# EAGLE design PPM2DSM (EAGLE 6.6.0)
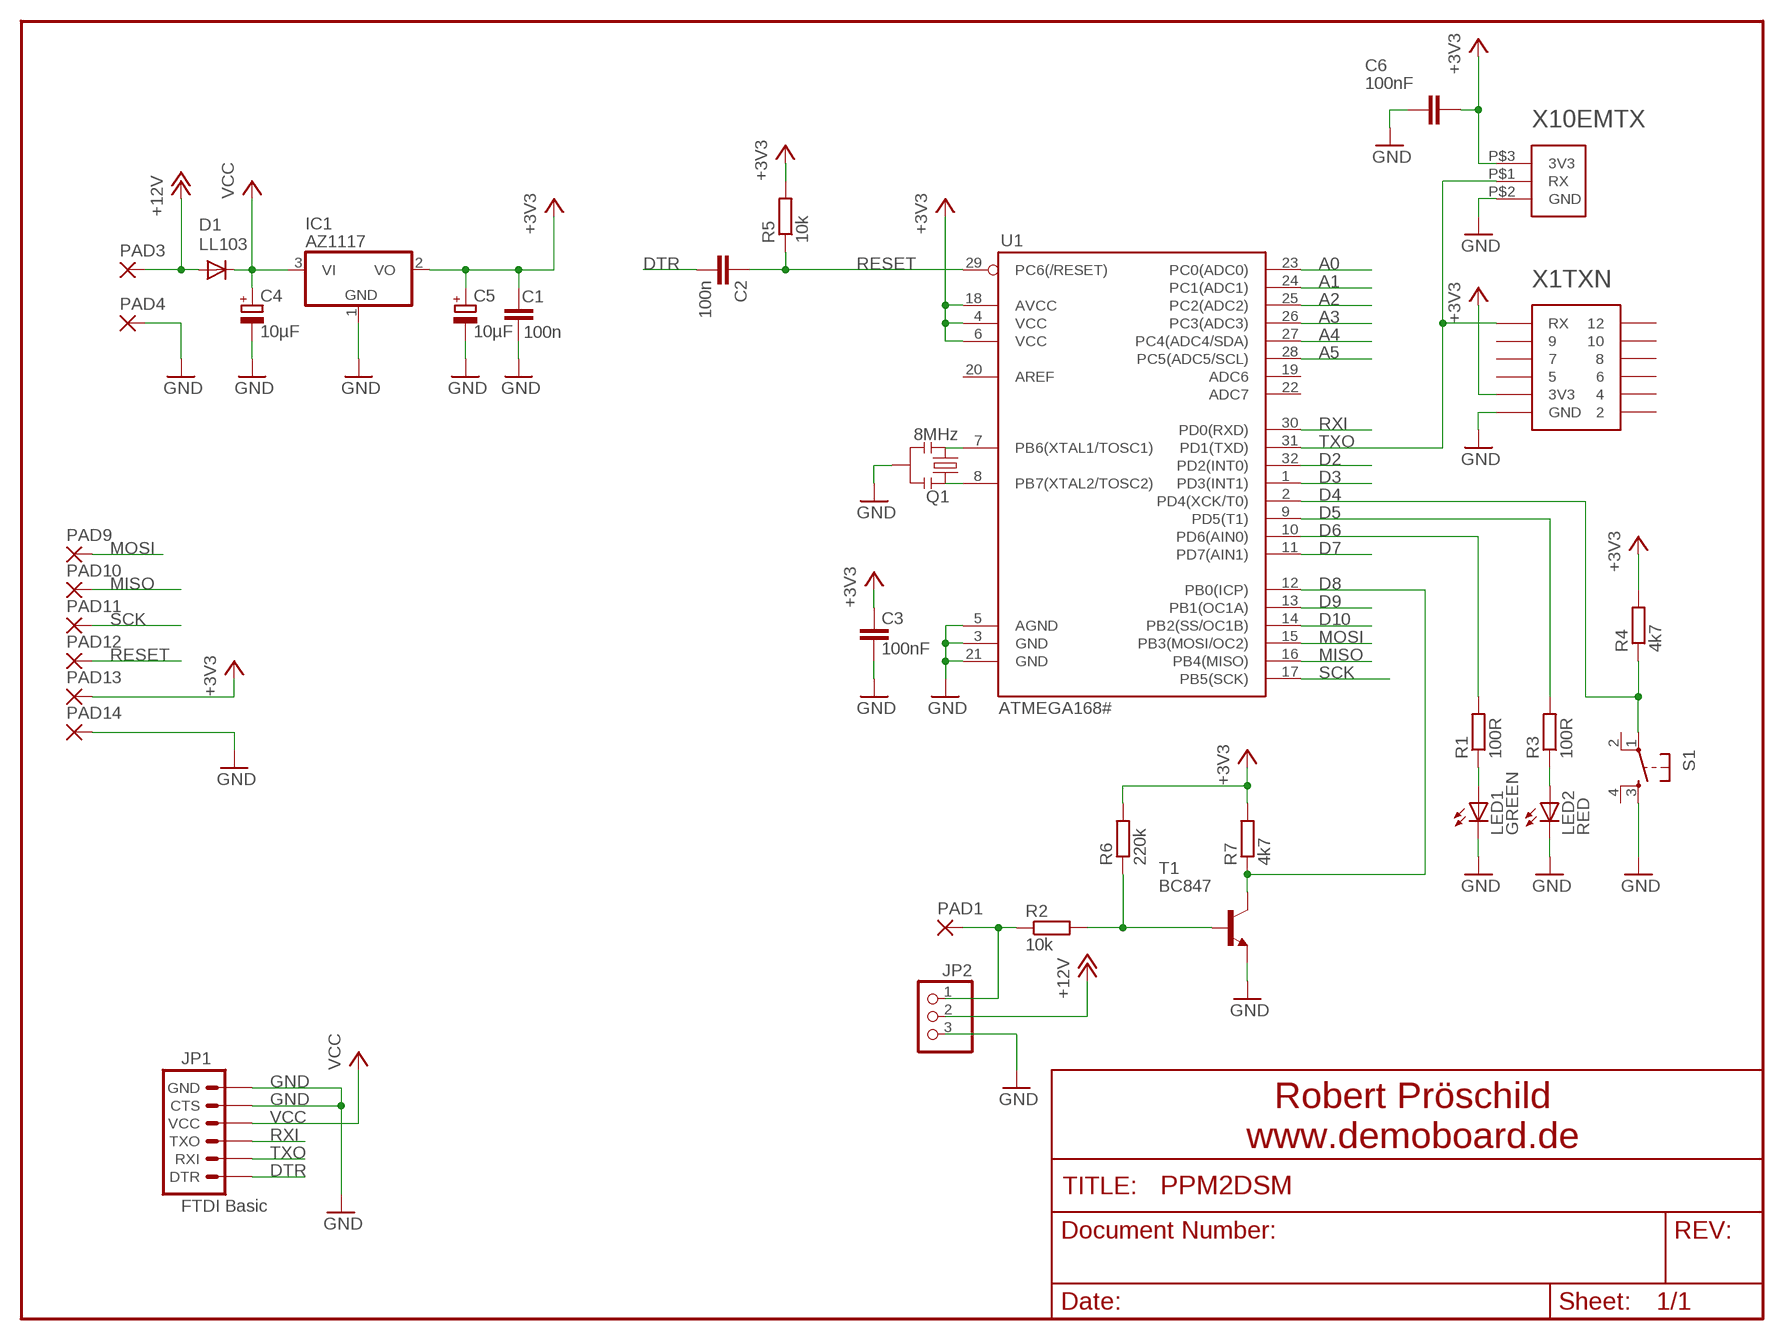
[diagram p0: schematic, sheet 1]

## Parts
C1  100n  C-EUC0805  [C0805]
C2  100n  C-EUC0805  [C0805]
C3  100nF  C-EUC0805  [C0805]
C4  10µF  CPOL-EUCT6032  [CT6032]
C5  10µF  CPOL-EUCT6032  [CT6032]
C6  100nF  C-EUC0805  [C0805]
D1  LL103  DIODE-MINIMELF  [MINIMELF]
IC1  AZ1117  [SOT223]
IC2  X10EMTX  [X10EMTX]
IC3  X1TX0  [X1TX0]
JP1  FTDI Basic  ARDUINO_SERIAL_PROGRAMPTH  [1X06]
JP2  PINHD-1X3/90  [1X03/90]
LED1  GREEN  LEDCHIPLED_1206  [CHIPLED_1206]
LED2  RED  LEDCHIPLED_1206  [CHIPLED_1206]
PAD1  SMD5  [SMD2,54-5,08]
PAD3  SMD5  [SMD2,54-5,08]
PAD4  SMD5  [SMD2,54-5,08]
PAD9  1,6/0,9  [1,6/0,9]
PAD10  1,6/0,9  [1,6/0,9]
PAD11  1,6/0,9  [1,6/0,9]
PAD12  1,6/0,9  [1,6/0,9]
PAD13  1,6/0,9  [1,6/0,9]
PAD14  1,6/0,9  [1,6/0,9]
Q1  8MHz  RESONATORSMD  [RESONATOR-SMD]
R1  100R  R-EU_R0805  [R0805]
R2  10k  R-EU_R0805  [R0805]
R3  100R  R-EU_R0805  [R0805]
R4  4k7  R-EU_R0805  [R0805]
R5  10k  R-EU_R0805  [R0805]
R6  220k  R-EU_R0805  [R0805]
R7  4k7  R-EU_R0805  [R0805]
S1  LSG  [SCHURTER_LSG]
T1  BC847  [SOT23]
U1  ATMEGA168#  ATMEGA168  [TQFP32-08]

## Nets
+3V3: C1.2 C3.2 C5.+ C6.2 IC1.2(VO) IC2.P$3(3V3) IC3.3(3V3) PAD13.1(P) R4.2 R5.2 R6.2 R7.2 U1.4(VCC) U1.6(VCC) U1.18(AVCC)
+12V: D1.A JP2.2 PAD3.1(P)
A0: U1.23(PC0(ADC0))
A1: U1.24(PC1(ADC1))
A2: U1.25(PC2(ADC2))
A3: U1.26(PC3(ADC3))
A4: U1.27(PC4(ADC4/SDA))
A5: U1.28(PC5(ADC5/SCL))
D2: U1.32(PD2(INT0))
D3: U1.1(PD3(INT1))
D4: R4.1 S1.1(P) U1.2(PD4(XCK/T0))
D5: R3.2 U1.9(PD5(T1))
D6: R1.2 U1.10(PD6(AIN0))
D7: U1.11(PD7(AIN1))
D8: R7.1 T1.3(C) U1.12(PB0(ICP))
D9: U1.13(PB1(OC1A))
D10: U1.14(PB2(SS/OC1B))
DTR: C2.2 JP1.1(DTR)
GND [vcc]: C1.1 C3.1 C4.- C5.- C6.1 IC1.1(GND) IC2.P$2(GND) IC3.1(GND) JP1.5(CTS) JP1.6(GND) JP2.3 LED1.C LED2.C PAD4.1(P) PAD14.1(P) Q1.2 S1.3(S) T1.2(E) U1.3(GND) U1.5(AGND) U1.21(GND)
MISO: PAD10.1(P) U1.16(PB4(MISO))
MOSI: PAD9.1(P) U1.15(PB3(MOSI/OC2))
N$1: Q1.1 U1.8(PB7(XTAL2/TOSC2))
N$2: Q1.3 U1.7(PB6(XTAL1/TOSC1))
N$5: R2.2 R6.1 T1.1(B)
N$6: JP2.1 PAD1.1(P) R2.1
N$7: LED1.A R1.1
N$38: LED2.A R3.1
RESET: C2.1 PAD12.1(P) R5.1 U1.29(PC6(/RESET))
RXI: JP1.3(TXO) U1.30(PD0(RXD))
SCK: PAD11.1(P) U1.17(PB5(SCK))
TXO: IC2.P$1(RX) IC3.11(RX) JP1.2(RXI) U1.31(PD1(TXD))
VCC: C4.+ D1.C IC1.3(VI) JP1.4(VCC)
Unconnected: IC3.5 IC3.6 IC3.7 IC3.8 IC3.9 IC3.10 IC3.12 S1.2(P1) S1.4(S1) U1.19(ADC6) U1.20(AREF) U1.22(ADC7)

## Notes on the sheet
- X10EMTX
- X1TXN
- Robert Pröschild
  www.demoboard.de

## Power pins joined to a net without a drawn wire
2: IC3.2
4: IC3.4

## Library data of the parts
C1-C3 C6 = rcl:C-EU: CAPACITOR, European symbol
C4 C5 = rcl:CPOL-EU: POLARIZED CAPACITOR, European symbol
D1 = diode:DIODE-: DIODE
IC1 = linear:AZ1117
IC2 = Spektrum:X10EMTX
IC3 = Spektrum:X1TX0
JP1 = SparkFun:ARDUINO_SERIAL_PROGRAM
JP2 = pinhead:PINHD-1X3: PIN HEADER
LED1 LED2 = led:LED: LED OSRAM: - CHIPLED LG R971, LG N971, LY N971, LG Q971, LY Q971, LO R971, LY R971 LH N974, LH R974 LS Q976, LO Q976, LY Q976 LO Q996 - Hyper CHIPLED LW Q18S LB Q993, LB Q99A, LB R99A - SideLED LS A670, LO A670, LY A670, LG A670, LP A670 LB A673, LV A673, LT A673, LW A673 LH A674 LY A675 LS A676, LA A676, LO A676, LY A676, LW A676 LS A679, LY A679, LG A679 - Hyper Micro SIDELED® LS Y876, LA Y876, LO Y876, LY Y876 LT Y87S - SmartLED LW L88C, LW L88S LB L89C, LB L89S, LG L890 LS L89K, LO L89K, LY L89K LS L896, LA L896, LO L896, LY L896 - TOPLED LS T670, LO T670, LY T670, LG T670, LP T670 LSG T670, LSP T670, LSY T670, LOP T670, LYG T670 LG T671, LOG T671, LSG T671 LB T673, LV T673, LT T673, LW T673 LH T674 LS T676, LA T676, LO T676, LY T676, LB T676, LH T676, LSB T676, LW T676 LB T67C, LV T67C, LT T67C, LS T67K, LO T67K, LY T67K, LW E67C LS E67B, LA E67B, LO E67B, LY E67B, LB E67C, LV E67C, LT E67C LW T67C LS T679, LY T679, LG T679 LS T770, LO T770, LY T770, LG T770, LP T770 LB T773, LV T773, LT T773, LW T773 LH T774 LS E675, LA E675, LY E675, LS T675 LS T776, LA T776, LO T776, LY T776, LB T776 LHGB T686 LT T68C, LB T68C - Hyper Mini TOPLED® LB M676 - Mini TOPLED Santana® LG M470 LS M47K, LO M47K, LY M47K Source: http://www.osram.convergy.de LUXEON: - LUMILED® LXK2-PW12-R00, LXK2-PW12-S00, LXK2-PW14-U00, LXK2-PW14-V00 LXK2-PM12-R00, LXK2-PM12-S00, LXK2-PM14-U00 LXK2-PE12-Q00, LXK2-PE12-R00, LXK2-PE12-S00, LXK2-PE14-T00, LXK2-PE14-U00 LXK2-PB12-K00, LXK2-PB12-L00, LXK2-PB12-M00, LXK2-PB14-N00, LXK2-PB14-P00, LXK2-PB14-Q00 LXK2-PR12-L00, LXK2-PR12-M00, LXK2-PR14-Q00, LXK2-PR14-R00 LXK2-PD12-Q00, LXK2-PD12-R00, LXK2-PD12-S00 LXK2-PH12-R00, LXK2-PH12-S00 LXK2-PL12-P00, LXK2-PL12-Q00, LXK2-PL12-R00 Source: www.luxeon.com KINGBRIGHT: KA-3528ASYC Source: www.kingbright.com
PAD1 PAD3 PAD4 = wirepad:SMD5: SMD PAD
PAD9-PAD14 = wirepad:1,6/0,9: THROUGH-HOLE PAD
Q1 = SparkFun:RESONATOR: Resonator Small SMD resonator. This is the itty bitty 10/20MHz resonators with built in caps. CSTCE10M0G55 and CSTCE20M0V53. Footprint has been reviewed closely but hasn't been tested yet.
R1-R7 = rcl:R-EU_: RESISTOR, European symbol
S1 = switch-omron:LSG
T1 = transistor:BC847: NPN TRANSISTOR
U1 = SparkFun:ATMEGA168

## Net classes
0 default: width 0.203 mm
1 vcc: width 0.254 mm

## Board
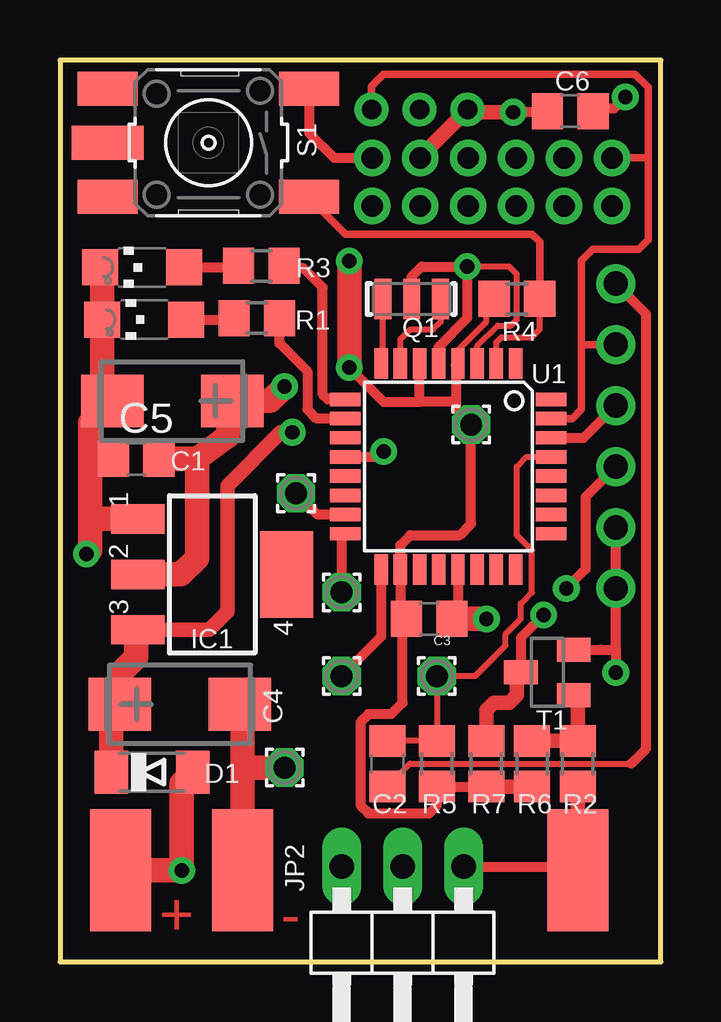
[diagram p1: board, top side]
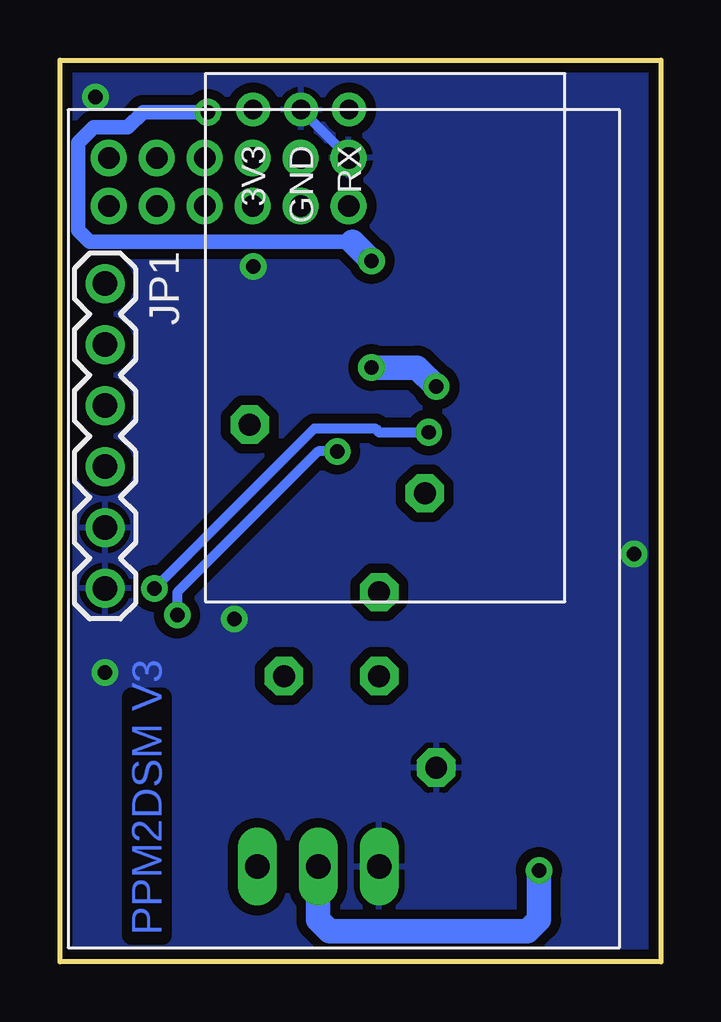
[diagram p2: board, bottom side, seen from below]

Size 25.05 x 37.58 mm. Coordinates in mm from the lower left corner, seen from the top.
Outline: 0,37.58 0,0 25.05,0 25.05,37.58 0,37.58
Copper layers (1*16): Top 0.035mm / dielectric 1.5mm / Bottom 0.035mm
Design rules "DerPlatinenbelichter": minimum track width 0.15mm, minimum drill 0.6mm, track to track 0.15mm, track to pad 0.15mm, pad to pad 0.15mm, via to via 0.15mm, smd to smd 0.15mm, copper to edge 10mil, drill to drill 8mil, minimum pad ring 12mil, minimum via ring 10mil, stop-mask expansion 4mil, vias tented up to drill 20mil, thermal gap 10mil

### Footprints (pad centres in the part's own frame; a part is rotated, then mirrored left to right if it is on the bottom)
C0805 = smd 1.3 x 1.5: 1 -0.95,0; 2 0.95,0
CT6032 = smd 2.6 x 2.2: + -2.5,0; - 2.5,0
MINIMELF = smd 1.4 x 1.8: A 1.7,0; C -1.7,0
SOT223 = smd 1.219 x 2.235: 1 -2.311,-3.099; 2 0,-3.099; 3 2.311,-3.099 | smd 3.6 x 2.2: 4 0,3.099
X10EMTX = drill 0.8: P$1 0,0; P$2 2,0; P$3 4,0
X1TX0 = drill 0.9: 1 0,0; 2 0,2; 3 2,0; 4 2,2; 5 4,0; 6 4,2; 7 6,0; 8 6,2; 9 8,0; 10 8,2; 11 10,0; 12 10,2
1X06 = drill 1.016: 1 0,0; 2 2.54,0; 3 5.08,0; 4 7.62,0; 5 10.16,0; 6 12.7,0
1X03/90 = drill 1.016 long: 1 -2.54,-3.81; 2 0,-3.81; 3 2.54,-3.81
CHIPLED_1206 = smd 1.5 x 1.5: A 0,-1.75; C 0,1.75
SMD2,54-5,08 = smd 2.54 x 5.08: 1 0,0
1,6/0,9 = drill 0.914 pad 1.6 octagon: 1 0,0
RESONATOR-SMD = smd 0.7 x 1.7: 1 -1.2,0; 2 0,0; 3 1.2,0
R0805 = smd 1.3 x 1.5: 1 -0.95,0; 2 0.95,0
SCHURTER_LSG = smd 2.5 x 1.4: 1 -4.2,2.25; 2 4.2,2.25; 3 -4.2,-2.25; 4 4.2,-2.25 | smd 3 x 1.4: 5 4.2,0
SOT23 = smd 1 x 1.4: 1 -0.95,-1.1; 2 0.95,-1.1; 3 0,1.1
TQFP32-08 = smd 1.27 x 0.559: 1 -4.293,2.8; 2 -4.293,2; 3 -4.293,1.2; 4 -4.293,0.4; 5 -4.293,-0.4; 6 -4.293,-1.2; 7 -4.293,-2; 8 -4.293,-2.8; 17 4.293,-2.8; 18 4.293,-2; 19 4.293,-1.2; 20 4.293,-0.4; 21 4.293,0.4; 22 4.293,1.2; 23 4.293,2; 24 4.293,2.8 | smd 0.559 x 1.27: 9 -2.8,-4.293; 10 -2,-4.293; 11 -1.2,-4.293; 12 -0.4,-4.293; 13 0.4,-4.293; 14 1.2,-4.293; 15 2,-4.293; 16 2.8,-4.293; 25 2.8,4.293; 26 2,4.293; 27 1.2,4.293; 28 0.4,4.293; 29 -0.4,4.293; 30 -1.2,4.293; 31 -2,4.293; 32 -2.8,4.293

### Placement (x,y rotation side)
C1  3.17,20.95 0 top
C2  13.65,8.26 270 top
C3  15.4,14.29 180 top
C4  5,10.73 0 top
C5  4.68,23.37 180 top
C6  21.28,35.45 180 top
D1  3.84,7.91 0 top
IC1  6.35,16.14 270 top
IC2  13,35.51 180 bottom
IC3  13.02,33.5 180 bottom
JP1  23.18,28.26 270 bottom
JP2  14.29,0.16 180 top
LED1  3.52,26.77 90 top
LED2  3.42,28.94 90 top
PAD1  21.59,3.81 0 top
PAD3  2.54,3.81 0 top
PAD4  7.62,3.81 0 top
PAD9  9.84,19.53 0 top
PAD10  11.75,15.4 0 top
PAD11  11.75,11.91 0 top
PAD12  15.72,11.91 0 top
PAD13  17.14,22.38 0 top
PAD14  9.37,8.1 0 top
Q1  14.67,27.62 0 top
R1  8.21,26.83 0 top
R2  21.59,8.26 90 top
R3  8.39,29 0 top
R4  19.05,27.62 180 top
R5  15.72,8.26 270 top
R6  19.68,8.26 270 top
R7  17.78,8.26 270 top
S1  6.19,34.13 180 top
T1  20.32,12.06 90 top
U1  16.19,20.64 270 top

### Tracks (layer width: path | path; a pad name or v marks a point on that pad's centre or on a via)
+3V3  (via drill 0.6)
  Top 0.254: U1.4 16.59,25.48 17.78,26.67 17.78,27.3
  Top 0.406: R7.2 R5.2 15.72,6.51 15.4,6.19 12.86,6.19 12.54,6.51 12.54,10 12.86,10.32 13.81,10.32 14.29,10.79 14.29,14.29 C3.2 14.19,14.29 U1.18 14.19,17.37 14.61,17.78 16.67,17.78 17.14,18.26 PAD13.1 16.51,23.02 16.51,23.34 | 17.78,27.3 R4.2 | U1.4 16.51,24.85 16.51,23.34 | 14.99,23.34 U1.6 | 16.51,23.34 14.99,23.34 | 14.99,23.34 13.49,23.34 v12.06,24.77 | C6.2 20.28,35.4 v18.89,35.4
  Top 0.61: R6.2 R7.2 | v18.89,35.4 17.11,35.4 IC2.P$3 15.02,33.53 IC3.3
  Top 1.016: IC1.2 5.03,16.14 5.71,16.83 5.71,20.95 | 5.71,20.95 6.99,21.91 C5.+ 8.77,23.37 v9.37,23.97 | C1.2 5.71,20.95 | v12.06,29.21 v12.06,24.77
  Bottom 0.61: v18.89,35.4 21.59,35.4 22.23,34.77 23.65,34.77 24.29,34.13 24.29,30.48 23.81,30 12.86,30
  Bottom 1.016: v12.06,24.77 10.16,24.77 v9.37,23.97 | 12.86,30 v12.06,29.21
+12V  (via drill 0.6)
  Top 1.016: PAD3.1 v5.08,3.81 5.08,7.45 D1.A
  Bottom 1.016: JP2.2 14.29,1.75 13.81,1.27 5.56,1.27 5.08,1.75 v5.08,3.81
D4
  Top 0.254: U1.2 18.19,25.81 18.41,26.04 19.68,26.04 20,26.35 R4.1
  Top 0.305: S1.1 10.39,31.84 11.91,30.32 19.68,30.32 20,30 R4.1
  Top 0.406: 19.68,27.31 R4.1
D5
  Top 0.406: U1.9 11.17,23.44 10.95,23.65 10.95,28.1 10.16,28.89 9.46,28.89 R3.2
D6
  Top 0.406: U1.10 10.7,22.64 10.32,23.02 10.32,24.61 9.15,25.77 R1.2
D8  (via drill 0.6)
  Top 0.406: v20.16,14.45 19.22,13.51 T1.3 | U1.12 13.26,21.04 v13.49,21.27
  Top 0.61: R7.1 17.78,10.48 18.1,10.79 18.73,10.79 19.05,11.11 19.05,11.89 T1.3
  Bottom 0.406: v20.16,14.45 20.16,15.4 14.29,21.27 v13.49,21.27
DTR
  Top 0.254: 23.81,8.26 14.6,8.26 C2.2
  Top 0.305: C2.2 13.97,7.3
  Top 0.406: 23.81,8.26 24.45,8.89 24.45,26.99 JP1.1
GND  (via drill 0.6)
  Top 0.254: 14.61,27.69 Q1.2 | U1.3 17.39,25.65 18.26,26.51 18.81,26.51 19.05,26.75 19.05,28.65 18.73,28.97 v16.99,28.97
  Top 0.406: 1.77,23.37 C5.- | U1.21 16.59,14.29 C3.1 | 22.54,13.02 T1.2 23.18,13.02 | 23.18,13.02 JP1.6 JP1.5 | 23.18,13.02 v23.18,12.06 | Q1.2 14.67,28.56 15.08,28.97 v16.99,28.97 16.99,26.83 15.79,25.64 U1.5 | S1.3 10.39,34.53 11.43,33.5 IC3.1 | C6.1 22.34,35.56 23.1,35.56 v23.57,36.04
  Top 1.016: 1.27,18.57 1.27,17.14 v1.11,16.99 | 1.27,18.57 1.27,21.27 | 1.27,21.27 1.27,22.45 C5.- 1.77,23.79 LED1.C 1.77,28.84 LED2.C | C1.1 1.59,20.95 1.27,21.27 | IC1.1 1.39,18.46 1.27,18.57 | 16.59,14.29 v17.78,14.29 | PAD4.1 7.62,8.26 | 7.62,8.26 7.62,10.61 C4.- | PAD14.1 7.78,8.1 7.62,8.26
  Bottom 0.406: IC2.P$2 13.02,33.53 IC3.1
  pour Bottom (isolate 0.406): 0.48,0.48 24.61,0.48 24.61,37.15 0.48,37.15
MISO
  Top 0.406: U1.16 11.75,17.68 PAD10.1
MOSI
  Top 0.406: U1.15 10.73,18.64 PAD9.1
N$1
  Top 0.254: U1.8 13.47,25.01 Q1.1
N$2
  Top 0.254: U1.7 14.19,25.94 14.61,26.35 15.56,26.35 15.88,26.67 Q1.3
N$5
  Top 0.61: R6.1 R2.2 21.59,10.95 T1.1
N$6
  Top 0.406: JP2.1 21.59,3.97 PAD1.1
  Top 0.61: PAD1.1 R2.1
N$7
  Top 0.406: LED1.A 7.19,26.77 R1.1
N$38
  Top 0.406: LED2.A 7.38,28.94 R3.1
RESET
  Top 0.254: U1.29 19.45,21.04 19.05,20.64 19.05,17.78 19.68,17.14 19.68,15.4 19.21,14.92 19.21,14.29 18.57,13.65 18.57,13.18 17.3,11.91 PAD12.1 R5.1 C2.1
RXI
  Top 0.406: U1.30 21.84,21.84 JP1.3
SCK
  Top 0.406: U1.17 13.39,13.55 PAD11.1
TXO
  Top 0.305: U1.31 21.37,22.64 21.75,23.02 21.75,25.72 | 21.75,25.72 JP1.2 | 21.75,25.72 21.75,29.21 22.23,29.69 24.13,29.69 24.53,30.08 24.53,33.5 | IC2.P$1 13,36.49 13.49,36.99 23.97,36.99 24.53,36.43 24.53,33.5 | IC3.11 24.53,33.5
VCC  (via drill 0.6)
  Top 0.406: JP1.4 21.91,19.37 21.91,16.35 v21.11,15.56
  Top 0.61: IC1.3 6.21,13.83 6.99,14.61 6.99,19.84 9.21,22.07 v9.68,22.07
  Top 1.016: D1.C 2.14,10.37 C4.+ 2.5,12.03 3.17,12.7 3.17,13.76 IC1.3
  Bottom 0.406: v21.11,15.56 14.45,22.23 11.91,22.23 11.75,22.07 v9.68,22.07

### Text on the board
Top: + | -
Bottom: PPM2DSM V3
tValues: Tent Vias! | Arduino Wee v1.3
Document: Copyright by / Robert Pröschild / proeschild@gmx.de / www.demoboard.de / only for private use